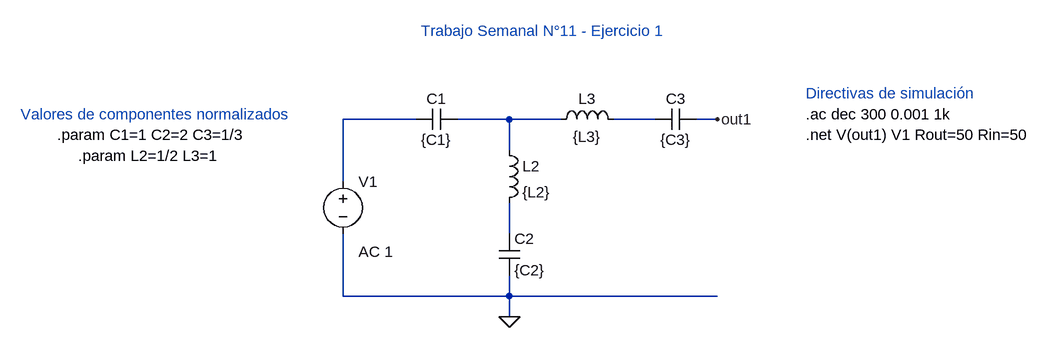
[diagram p0: schematic TS11_ej1.asc]
TS11_ej1.asc, the LTspice schematic file:
Version 4
SHEET 1 1144 680
WIRE 160 176 48 176
WIRE 304 176 224 176
WIRE 384 176 304 176
WIRE 528 176 464 176
WIRE 624 176 592 176
WIRE 304 224 304 176
WIRE 48 272 48 176
WIRE 304 352 304 304
WIRE 48 448 48 352
WIRE 304 448 304 416
WIRE 304 448 48 448
WIRE 624 448 304 448
WIRE 304 480 304 448
FLAG 304 480 0
FLAG 624 176 out1
SYMBOL cap 224 160 R90
WINDOW 0 0 32 VBottom 2
WINDOW 3 32 32 VTop 2
SYMATTR InstName C1
SYMATTR Value {C1}
SYMBOL cap 288 352 R0
SYMATTR InstName C2
SYMATTR Value {C2}
SYMBOL cap 592 160 R90
WINDOW 0 0 32 VBottom 2
WINDOW 3 32 32 VTop 2
SYMATTR InstName C3
SYMATTR Value {C3}
SYMBOL ind 288 208 R0
SYMATTR InstName L2
SYMATTR Value {L2}
SYMBOL ind 368 192 R270
WINDOW 0 32 56 VTop 2
WINDOW 3 5 56 VBottom 2
SYMATTR InstName L3
SYMATTR Value {L3}
SYMBOL voltage 48 256 R0
WINDOW 123 24 124 Left 2
WINDOW 39 0 0 Left 0
SYMATTR Value2 AC 1
SYMATTR InstName V1
SYMATTR Value ""
TEXT -448 168 Left 2 ;Valores de componentes normalizados
TEXT -392 200 Left 2 !.param C1=1 C2=2 C3=1/3
TEXT -360 232 Left 2 !.param L2=1/2 L3=1
TEXT 760 200 Left 2 !.net V(out1) V1 Rout=50 Rin=50
TEXT 760 168 Left 2 !.ac dec 300 0.001 1k
TEXT 168 40 Left 2 ;Trabajo Semanal N°11 - Ejercicio 1
TEXT 760 136 Left 2 ;Directivas de simulación

The netlist it stands for:
* TS11_ej1.asc
C1 N002 N001 {C1}
C2 N004 0 {C2}
C3 out1 N003 {C3}
L2 N002 N004 {L2}
L3 N002 N003 {L3}
V1 N001 0 AC 1
* Valores de componentes normalizados
.param C1=1 C2=2 C3=1/3
.param L2=1/2 L3=1
.net V(out1) V1 Rout=50 Rin=50
.ac dec 300 0.001 1k
* Trabajo Semanal N°11 - Ejercicio 1
* Directivas de simulación
.backanno
.end